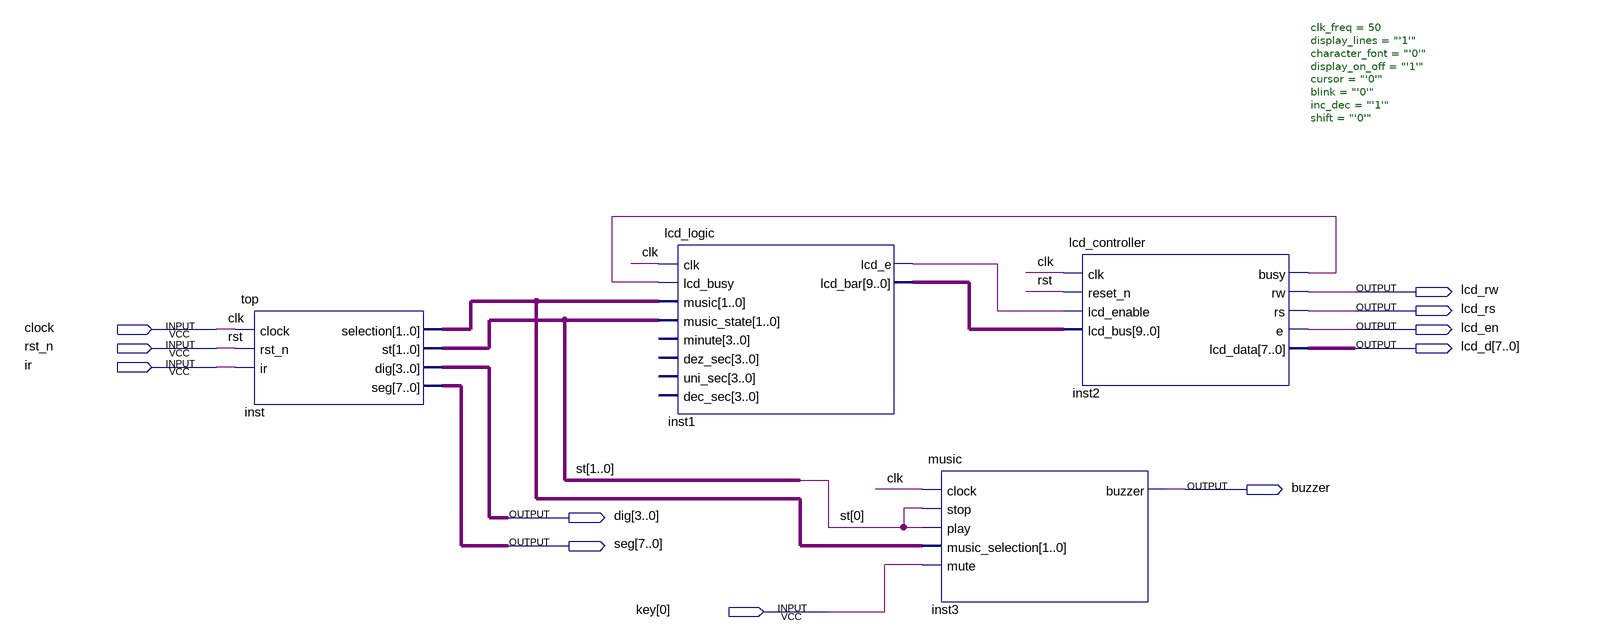
[diagram p0: schematic sheet]
// Quartus schematic test.bdf as structural Verilog: 4 symbols, 11 pins
module test (
  input  clock,
  input  rst_n,
  input  ir,
  input  [0:0] key,
  output lcd_rw,
  output lcd_rs,
  output lcd_en,
  output [7:0] lcd_d,
  output buzzer,
  output [3:0] dig,
  output [7:0] seg
);

  wire inst1_lcd_e, inst2_busy;
  wire [1:0] inst_selection, st;
  wire [9:0] inst1_lcd_bar;

  top inst (.clock(clock), .rst_n(rst_n), .ir(ir), .selection(inst_selection), .st(st), .dig(dig), .seg(seg));
  lcd_logic inst1 (
    .clk(clock), .lcd_busy(inst2_busy), .music(inst_selection), .music_state(st), .lcd_e(inst1_lcd_e),
    .lcd_bar(inst1_lcd_bar));  // open: minute, dez_sec, uni_sec, dec_sec
  music inst3 (
    .clock(clock), .stop(st[0]), .play(st[0]), .music_selection(inst_selection), .mute(key[0]),
    .buzzer(buzzer));
  lcd_controller #(.clk_freq(50), .display_lines("'1'"), .character_font("'0'"), .display_on_off("'1'"), .cursor("'0'"), .blink("'0'"), .inc_dec("'1'"), .shift("'0'")) inst2 (
    .clk(clock), .reset_n(rst_n), .lcd_enable(inst1_lcd_e), .lcd_bus(inst1_lcd_bar), .busy(inst2_busy),
    .rw(lcd_rw), .rs(lcd_rs), .e(lcd_en), .lcd_data(lcd_d));

  // Other names for the same wires on the sheet: clk = clock; rst = rst_n
endmodule
